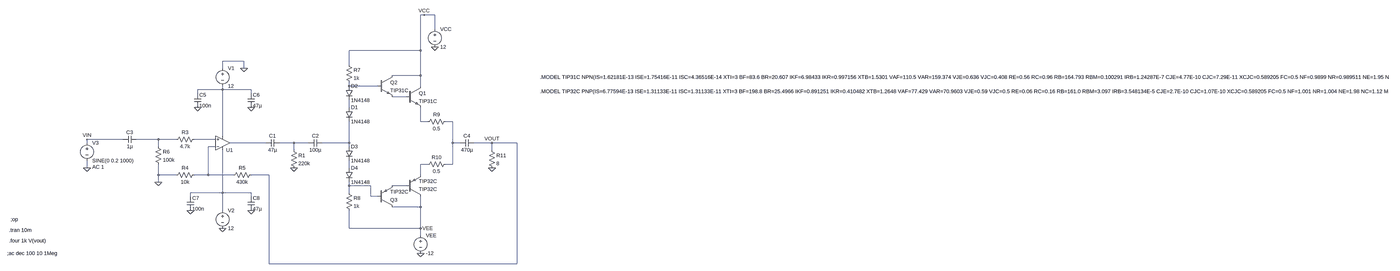
[diagram p0: schematic AUDIO_AMPLIFIER_CIRCUIT (1).asc, whole sheet]
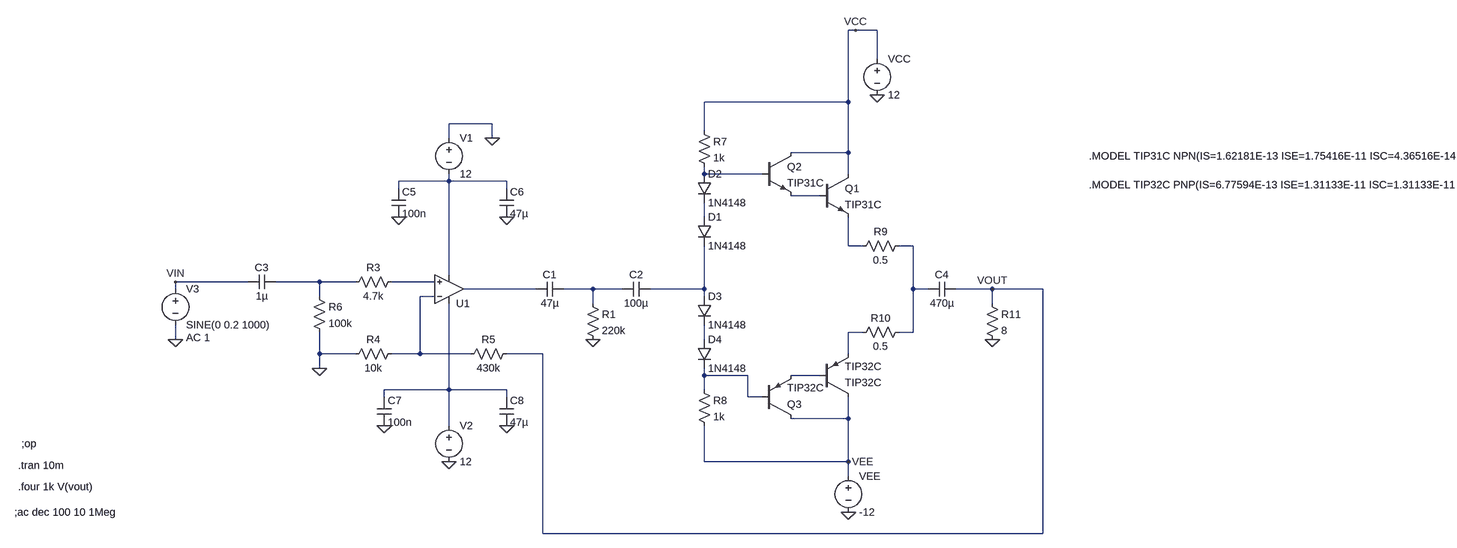
[diagram p1: schematic AUDIO_AMPLIFIER_CIRCUIT (1).asc, part, row 1 of 1, column 1 of 2]
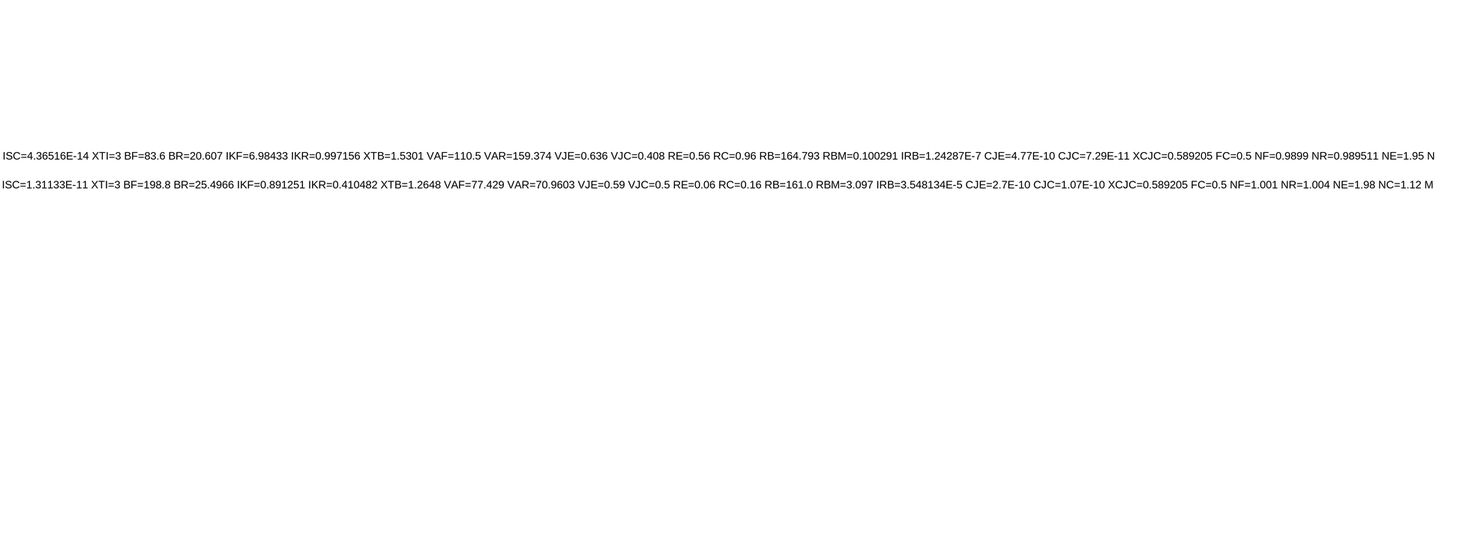
[diagram p2: schematic AUDIO_AMPLIFIER_CIRCUIT (1).asc, part, row 1 of 1, column 2 of 2]
AUDIO_AMPLIFIER_CIRCUIT (1).asc, the LTspice schematic file:
Version 4
SHEET 1 7540 804
WIRE 1296 -384 1280 -384
WIRE 1344 -384 1296 -384
WIRE 1344 -320 1344 -384
WIRE 1280 -224 1280 -384
WIRE 1280 -224 960 -224
WIRE 320 -176 224 -176
WIRE 960 -160 960 -224
WIRE 224 -144 224 -176
WIRE 320 -144 320 -176
WIRE 1280 -112 1280 -224
WIRE 1280 -112 1152 -112
WIRE 960 -64 960 -80
WIRE 1088 -64 960 -64
WIRE 1280 -64 1280 -112
WIRE 224 -48 224 -64
WIRE 224 -48 112 -48
WIRE 352 -48 224 -48
WIRE 112 -32 112 -48
WIRE 352 -32 352 -48
WIRE 1216 -16 1152 -16
WIRE 960 32 960 0
WIRE 1280 96 1280 32
WIRE 1312 96 1280 96
WIRE 1424 96 1392 96
WIRE 224 160 224 -48
WIRE -224 176 -384 176
WIRE -64 176 -160 176
WIRE 16 176 -64 176
WIRE 192 176 96 176
WIRE -384 192 -384 176
WIRE 416 192 256 192
WIRE 544 192 480 192
WIRE 608 192 544 192
WIRE 960 192 960 96
WIRE 960 192 672 192
WIRE 1424 192 1424 96
WIRE 1456 192 1424 192
WIRE 1600 192 1520 192
WIRE 1712 192 1600 192
WIRE -64 208 -64 176
WIRE 192 208 160 208
WIRE 960 208 960 192
WIRE 544 224 544 192
WIRE 1600 224 1600 192
WIRE 1312 288 1280 288
WIRE 1424 288 1424 192
WIRE 1424 288 1392 288
WIRE -384 304 -384 272
WIRE 960 304 960 272
WIRE -64 336 -64 288
WIRE 16 336 -64 336
WIRE 160 336 160 208
WIRE 160 336 96 336
WIRE 272 336 160 336
WIRE 432 336 352 336
WIRE 1280 336 1280 288
WIRE -64 368 -64 336
WIRE 960 384 960 368
WIRE 1056 384 960 384
WIRE 1216 384 1152 384
WIRE 224 416 224 224
WIRE 224 416 80 416
WIRE 352 416 224 416
WIRE 960 416 960 384
WIRE 80 432 80 416
WIRE 352 432 352 416
WIRE 1056 432 1056 384
WIRE 1088 432 1056 432
WIRE 1280 480 1280 432
WIRE 1280 480 1152 480
WIRE 224 496 224 416
WIRE 960 576 960 496
WIRE 1280 576 1280 480
WIRE 1280 576 960 576
WIRE 1280 608 1280 576
WIRE 432 736 432 336
WIRE 1712 736 1712 192
WIRE 1712 736 432 736
FLAG 1600 304 0
FLAG 1280 688 0
FLAG 1344 -240 0
FLAG 1600 192 VOUT
FLAG -64 368 0
FLAG -384 304 0
FLAG 352 496 0
FLAG 224 576 0
FLAG 80 496 0
FLAG 112 32 0
FLAG 352 32 0
FLAG 320 -144 0
FLAG 544 304 0
FLAG -384 176 VIN
FLAG 1296 -384 VCC
FLAG 1280 576 VEE
SYMBOL diode 944 32 R0
SYMATTR InstName D1
SYMATTR Value 1N4148
SYMBOL res 944 -176 R0
SYMATTR InstName R7
SYMATTR Value 1k
SYMBOL res 944 400 R0
SYMATTR InstName R8
SYMATTR Value 1k
SYMBOL res 1296 112 R270
WINDOW 0 32 56 VTop 2
WINDOW 3 0 56 VBottom 2
SYMATTR InstName R9
SYMATTR Value 0.5
SYMBOL res 1296 304 R270
WINDOW 0 32 56 VTop 2
WINDOW 3 0 56 VBottom 2
SYMATTR InstName R10
SYMATTR Value 0.5
SYMBOL res 1584 208 R0
SYMATTR InstName R11
SYMATTR Value 8
SYMBOL voltage 1280 592 R0
WINDOW 123 0 0 Left 0
WINDOW 39 0 0 Left 0
SYMATTR InstName VEE
SYMATTR Value -12
SYMBOL voltage 1344 -336 R0
WINDOW 123 0 0 Left 0
WINDOW 39 0 0 Left 0
SYMATTR InstName VCC
SYMATTR Value 12
SYMBOL OpAmps\\UniversalOpAmp2 224 192 M180
SYMATTR InstName U1
SYMATTR Value2 Avol=1Meg GBW=3Meg Slew=13Meg
SYMATTR SpiceLine Ilimit=50m Rail=0 Vos=0
SYMBOL res 0 192 R270
WINDOW 0 32 56 VTop 2
WINDOW 3 0 56 VBottom 2
SYMATTR InstName R3
SYMATTR Value 4.7k
SYMBOL res 0 352 R270
WINDOW 0 32 56 VTop 2
WINDOW 3 0 56 VBottom 2
SYMATTR InstName R4
SYMATTR Value 10k
SYMBOL res 256 352 R270
WINDOW 0 32 56 VTop 2
WINDOW 3 0 56 VBottom 2
SYMATTR InstName R5
SYMATTR Value 430k
SYMBOL res -80 192 R0
SYMATTR InstName R6
SYMATTR Value 100k
SYMBOL cap -224 192 R270
WINDOW 0 32 32 VTop 2
WINDOW 3 0 32 VBottom 2
SYMATTR InstName C3
SYMATTR Value 1µ
SYMBOL voltage 224 -160 R0
SYMATTR InstName V1
SYMATTR Value 12
SYMBOL voltage 224 480 R0
WINDOW 123 0 0 Left 0
WINDOW 39 0 0 Left 0
SYMATTR InstName V2
SYMATTR Value 12
SYMBOL voltage -384 176 R0
WINDOW 123 24 124 Left 2
WINDOW 39 0 0 Left 0
SYMATTR Value2 AC 1
SYMATTR InstName V3
SYMATTR Value SINE(0 0.2 1000)
SYMBOL cap 96 -32 R0
SYMATTR InstName C5
SYMATTR Value 100n
SYMBOL cap 336 -32 R0
SYMATTR InstName C6
SYMATTR Value 47µ
SYMBOL cap 64 432 R0
SYMATTR InstName C7
SYMATTR Value 100n
SYMBOL cap 336 432 R0
SYMATTR InstName C8
SYMATTR Value 47µ
SYMBOL npn 1216 -64 R0
SYMATTR InstName Q1
SYMATTR Value TIP31C
SYMBOL pnp 1216 432 M180
SYMATTR InstName TIP32C
SYMATTR Value TIP32C
SYMBOL cap 416 208 R270
WINDOW 0 32 32 VTop 2
WINDOW 3 0 32 VBottom 2
SYMATTR InstName C1
SYMATTR Value 47µ
SYMBOL res 528 208 R0
SYMATTR InstName R1
SYMATTR Value 220k
SYMBOL cap 608 208 R270
WINDOW 0 32 32 VTop 2
WINDOW 3 0 32 VBottom 2
SYMATTR InstName C2
SYMATTR Value 100µ
SYMBOL npn 1088 -112 R0
SYMATTR InstName Q2
SYMATTR Value TIP31C
SYMBOL pnp 1088 480 M180
SYMATTR InstName Q3
SYMATTR Value TIP32C
SYMBOL cap 1456 208 R270
WINDOW 0 32 32 VTop 2
WINDOW 3 0 32 VBottom 2
SYMATTR InstName C4
SYMATTR Value 470µ
SYMBOL diode 944 -64 R0
SYMATTR InstName D2
SYMATTR Value 1N4148
SYMBOL diode 944 208 R0
SYMATTR InstName D3
SYMATTR Value 1N4148
SYMBOL diode 944 304 R0
SYMATTR InstName D4
SYMATTR Value 1N4148
TEXT 1880 -104 Left 2 !.MODEL TIP31C NPN(IS=1.62181E-13 ISE=1.75416E-11 ISC=4.36516E-14 XTI=3 BF=83.6 BR=20.607 IKF=6.98433 IKR=0.997156 XTB=1.5301 VAF=110.5 VAR=159.374 VJE=0.636 VJC=0.408 RE=0.56 RC=0.96 RB=164.793 RBM=0.100291 IRB=1.24287E-7 CJE=4.77E-10 CJC=7.29E-11 XCJC=0.589205 FC=0.5 NF=0.9899 NR=0.989511 NE=1.95 NC=1.014 MJE=0.327 MJC=0.339 TF=2.3733E-8 TR=1.0000E-8 ITF=1 VTF=10 XTF=10 EG=1.1605 VCEO=100 ICRATING=3 MFG=TEXAS)
TEXT 1880 -40 Left 2 !.MODEL TIP32C PNP(IS=6.77594E-13 ISE=1.31133E-11 ISC=1.31133E-11 XTI=3 BF=198.8 BR=25.4966 IKF=0.891251 IKR=0.410482 XTB=1.2648 VAF=77.429 VAR=70.9603 VJE=0.59 VJC=0.5 RE=0.06 RC=0.16 RB=161.0 RBM=3.097 IRB=3.548134E-5 CJE=2.7E-10 CJC=1.07E-10 XCJC=0.589205 FC=0.5 NF=1.001 NR=1.004 NE=1.98 NC=1.12 MJE=0.319 MJC=0.352 TF=2.3733E-8 TR=1.0000E-8 ITF=1 VTF=10 XTF=10 EG=1.0863 VCEO=100 ICRATING=3 MFG=TEXAS)
TEXT -864 584 Left 2 !.tran 10m
TEXT -864 632 Left 2 !.four 1k V(vout)
TEXT -872 688 Left 2 !;ac dec 100 10 1Meg
TEXT -856 536 Left 2 !;op

The netlist it stands for:
* AUDIO_AMPLIFIER_CIRCUIT (1).asc
D1 N004 N011 1N4148
R7 VCC N001 1k
R8 N015 VEE 1k
R9 N005 N006 0.5
R10 N013 N006 0.5
R11 VOUT 0 8
VEE VEE 0 -12
VCC VCC 0 12
XU1 N008 N012 N017 N002 N009 level2 Avol=1Meg GBW=3Meg Slew=13Meg Ilimit=50m Rail=0 Vos=0 En=0 Enk=0 In=0 Ink=0 Rin=500Meg  ; pins In+ In- V+ V- OUT
R3 N007 N008 4.7k
R4 0 N012 10k
R5 N012 VOUT 430k
R6 N007 0 100k
C3 VIN N007 1µ
V1 0 N002 12
V2 N017 0 12
V3 VIN 0 SINE(0 0.2 1000) AC 1
C5 N002 0 100n
C6 N002 0 47µ
C7 N017 0 100n
C8 N017 0 47µ
Q1 VCC N003 N005 0 TIP31C
Q§TIP32C VEE N016 N013 0 TIP32C
C1 N009 N010 47µ
R1 N010 0 220k
C2 N010 N011 100µ
Q2 VCC N001 N003 0 TIP31C
Q3 VEE N015 N016 0 TIP32C
C4 N006 VOUT 470µ
D2 N001 N004 1N4148
D3 N011 N014 1N4148
D4 N014 N015 1N4148
.model D D
.lib standard.dio
.model NPN NPN
.model PNP PNP
.lib standard.bjt
.MODEL TIP31C NPN(IS=1.62181E-13 ISE=1.75416E-11 ISC=4.36516E-14 XTI=3 BF=83.6 BR=20.607 IKF=6.98433 IKR=0.997156 XTB=1.5301 VAF=110.5 VAR=159.374 VJE=0.636 VJC=0.408 RE=0.56 RC=0.96 RB=164.793 RBM=0.100291 IRB=1.24287E-7 CJE=4.77E-10 CJC=7.29E-11 XCJC=0.589205 FC=0.5 NF=0.9899 NR=0.989511 NE=1.95 NC=1.014 MJE=0.327 MJC=0.339 TF=2.3733E-8 TR=1.0000E-8 ITF=1 VTF=10 XTF=10 EG=1.1605 VCEO=100 ICRATING=3 MFG=TEXAS)
.MODEL TIP32C PNP(IS=6.77594E-13 ISE=1.31133E-11 ISC=1.31133E-11 XTI=3 BF=198.8 BR=25.4966 IKF=0.891251 IKR=0.410482 XTB=1.2648 VAF=77.429 VAR=70.9603 VJE=0.59 VJC=0.5 RE=0.06 RC=0.16 RB=161.0 RBM=3.097 IRB=3.548134E-5 CJE=2.7E-10 CJC=1.07E-10 XCJC=0.589205 FC=0.5 NF=1.001 NR=1.004 NE=1.98 NC=1.12 MJE=0.319 MJC=0.352 TF=2.3733E-8 TR=1.0000E-8 ITF=1 VTF=10 XTF=10 EG=1.0863 VCEO=100 ICRATING=3 MFG=TEXAS)
.tran 10m
.four 1k V(vout)
;ac dec 100 10 1Meg
;op
.lib UniversalOpAmp2.lib
.backanno
.end